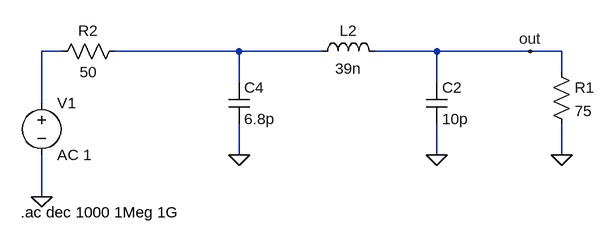
[diagram p0: schematic matching_LPF.asc]
matching_LPF.asc, the LTspice schematic file:
Version 4
SHEET 1 880 680
WIRE -592 112 -624 112
WIRE -320 112 -512 112
WIRE -192 112 -320 112
WIRE -16 112 -112 112
WIRE 128 112 -16 112
WIRE 176 112 128 112
WIRE 176 144 176 112
WIRE -320 160 -320 112
WIRE -16 160 -16 112
WIRE -624 192 -624 112
WIRE -320 272 -320 224
WIRE -16 272 -16 224
WIRE 176 272 176 224
WIRE -624 336 -624 272
FLAG 176 272 0
FLAG -16 272 0
FLAG -320 272 0
FLAG -624 336 0
FLAG 128 112 out
SYMBOL res 160 128 R0
SYMATTR InstName R1
SYMATTR Value 75
SYMBOL cap -32 160 R0
SYMATTR InstName C2
SYMATTR Value 10p
SYMBOL ind -208 128 R270
WINDOW 0 32 56 VTop 2
WINDOW 3 5 56 VBottom 2
SYMATTR InstName L2
SYMATTR Value 39n
SYMATTR SpiceLine Rser=0.01
SYMBOL cap -336 160 R0
SYMATTR InstName C4
SYMATTR Value 6.8p
SYMBOL res -496 96 R90
WINDOW 0 0 56 VBottom 2
WINDOW 3 32 56 VTop 2
SYMATTR InstName R2
SYMATTR Value 50
SYMBOL voltage -624 176 R0
SYMATTR InstName V1
SYMATTR Value AC 1
TEXT -656 360 Left 2 !.ac dec 1000 1Meg 1G

The netlist it stands for:
* matching_LPF.asc
R1 out 0 75
C2 out 0 10p
L2 N002 out 39n Rser=0.01
C4 N002 0 6.8p
R2 N002 N001 50
V1 N001 0 AC 1
.ac dec 1000 1Meg 1G
.backanno
.end